# Altium schematic sheet AT89S52多功能板.SchDoc
size A4
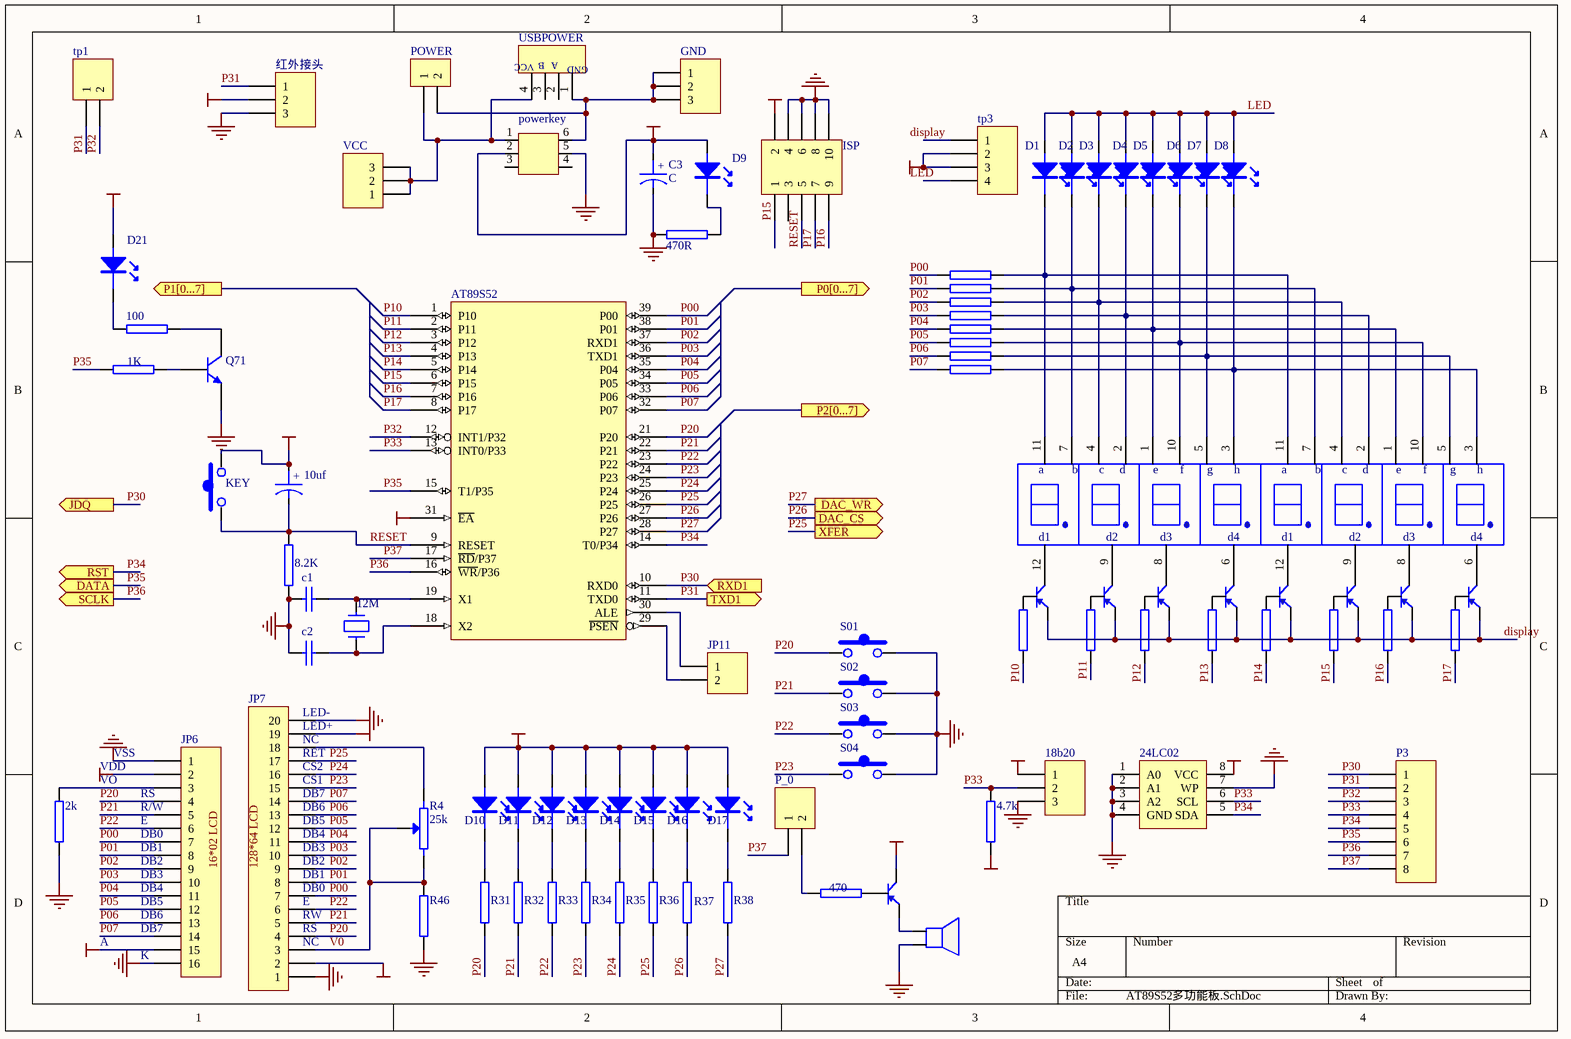
[diagram p0: AT89S52多功能板.SchDoc]

## Parts
1  NPN1  [NPN1PF]  (value not drawn)
1K  RES34  [RES1PF]  (value not drawn)
2  2  [NPN1PF]  (value not drawn)
2k  R5  [RES1PF]  (value not drawn)
3  3  [NPN1PF]  (value not drawn)
4  NPN1  [NPN1PF]  (value not drawn)
4.7k  RES1  [RES1PF]  (value not drawn)
5  NPN1  [NPN1PF]  (value not drawn)
6  NPN1  [NPN1PF]  (value not drawn)
7  NPN1  [NPN1PF]  (value not drawn)
8  NPN1  [NPN1PF]  (value not drawn)
8.2K  RES1  [RES1PF]  (value not drawn)
10  NPN1  [NPN1PF]  (value not drawn)
10uf  10uf  [cap2]  (value not drawn)
12M  12M  [CRYSTAL]  (value not drawn)
18b20  CON3  [HDR1X3]  (value not drawn)
24LC02  24LC02  [DIP8]  (value not drawn)
100  RES2  [RES1PF]  (value not drawn)
211  USBPOWER  [USBPOWER1]
470  R2  [RES1PF]  (value not drawn)
470R  R1  [RES1PF]  (value not drawn)
1111  LED8  [LED8PF]  (value not drawn)
1112  LED8  [LED8PF]  (value not drawn)
*  LS1  [LS1PF]  (value not drawn)
AT89S52  AT89S52  [AT89S52PF]  (value not drawn)
c1  C  [RAD0.3]  (value not drawn)
c2  15p  [RAD0.3]  (value not drawn)
C3  C  [RAD0.3]
D1  LED  [RES1PF]  (value not drawn)
D2  LED  [RES1PF]  (value not drawn)
D3  LED  [RES1PF]  (value not drawn)
D4  LED  [RES1PF]  (value not drawn)
D5  LED  [RES1PF]  (value not drawn)
D6  LED  [RES1PF]  (value not drawn)
D7  LED  [RES1PF]  (value not drawn)
D8  LED  [RES1PF]  (value not drawn)
D9  LED  [RES1PF]  (value not drawn)
D10  LED  [RES1PF]  (value not drawn)
D11  LED  [RES1PF]  (value not drawn)
D12  LED  [RES1PF]  (value not drawn)
D13  LED  [RES1PF]  (value not drawn)
D14  LED  [RES1PF]  (value not drawn)
D15  LED  [RES1PF]  (value not drawn)
D16  LED  [RES1PF]  (value not drawn)
D17  LED  [RES1PF]  (value not drawn)
D21  LED  [LED]  (value not drawn)
GND  公共电源  [HDR1X3]  (value not drawn)
ISP  download  [HDR2X5]  (value not drawn)
JP6  Header 16  [HDR1X16]  (value not drawn)
JP7  (no value)  [HDR1X20]
JP11  Header 2  [HDR1X2]  (value not drawn)
P3  Header 8  [HDR1X8]  (value not drawn)
P_0  Header 2  [HDR1X2]  (value not drawn)
POWER  POWER  [POWERPF]  (value not drawn)
powerkey  POWERKEY  [POWERKEY1]  (value not drawn)
Q71  2N3904  [TO-92A]  (value not drawn)
R4  25k  [SIP3-D]
R11  RES1  [RES1PF]  (value not drawn)
R12  RES1  [RES1PF]  (value not drawn)
R13  RES1  [RES1PF]  (value not drawn)
R14  RES1  [RES1PF]  (value not drawn)
R15  RES1  [RES1PF]  (value not drawn)
R16  RES1  [RES1PF]  (value not drawn)
R17  RES1  [RES1PF]  (value not drawn)
R18  RES1  [RES1PF]  (value not drawn)
R21  RES1  [RES1PF]  (value not drawn)
R22  RES1  [RES1PF]  (value not drawn)
R23  RES1  [RES1PF]  (value not drawn)
R24  RES1  [RES1PF]  (value not drawn)
R25  RES1  [RES1PF]  (value not drawn)
R26  RES1  [RES1PF]  (value not drawn)
R27  RES1  [RES1PF]  (value not drawn)
R28  RES1  [RES1PF]  (value not drawn)
R31  RES1  [RES1PF]  (value not drawn)
R32  RES1  [RES1PF]  (value not drawn)
R33  RES1  [RES1PF]  (value not drawn)
R34  RES1  [RES1PF]  (value not drawn)
R35  RES1  [RES1PF]  (value not drawn)
R36  RES1  [RES1PF]  (value not drawn)
R37  RES1  [RES1PF]  (value not drawn)
R38  RES1  [RES1PF]  (value not drawn)
R46  RES1  [RES1PF]  (value not drawn)
reset  KEY  [keypf]
S01  KEY  [KEYPF]  (value not drawn)
S02  KEY  [KEYPF]  (value not drawn)
S03  KEY  [KEYPF]  (value not drawn)
S04  KEY  [KEYPF]  (value not drawn)
tp1  Header 2  [HDR1X2]  (value not drawn)
tp3  Header 4  [HDR1X4]  (value not drawn)
VCC  (no value)  [HDR1X3]
红外接头  Header 3  [HDR1X3]  (value not drawn)

## Ports
DAC_CS (out), DAC_WR (out), DATA (out), JDQ (out), P0[0...7] (out), P1[0...7] (out), P2[0...7] (out), RST (out), RXD1 (in), SCLK (out), TXD1 (out), XFER (out)

## Nets
GND: 2k.1 8.2K.2 18b20.3 24LC02.1(A0) 24LC02.2(A1) 24LC02.3(A2) 24LC02.4(GND) 24LC02.7(WP) 470R.2 *.2 AT89S52.20(GND) c1.1 c2.1 C3.2 ISP.4 ISP.6 ISP.8 ISP.10 JP6.1 JP6.16 JP7.1 JP7.20 powerkey.5 Q71.1(E) R46.1 S01.2 S02.2 S03.2 S04.2 红外接头.3
VCC: 4.7k.1 10.c 10uf.1 18b20.1 24LC02.8(VCC) AT89S52.31(~{EA}) AT89S52.40(VCC) C3.1 D9.1(A) D10.1(A) D11.1(A) D12.1(A) D13.1(A) D14.1(A) D15.1(A) D16.1(A) D17.1(A) D21.1(A) ISP.2 JP6.2 JP6.15 JP7.2 JP7.19 powerkey.2 reset.2 tp3.2 tp3.3 红外接头.2
display: 1.e 2.e 3.e 4.e 5.e 6.e 7.e 8.e
LED: D1.1(A) D2.1(A) D3.1(A) D4.1(A) D5.1(A) D6.1(A) D7.1(A) D8.1(A)
P00: AT89S52.39(P00) JP6.7 JP7.7 R21.1
P01: AT89S52.38(P01) JP6.8 JP7.8 R22.1
P02: AT89S52.37(RXD1) JP6.9 JP7.9 R23.1
P03: AT89S52.36(TXD1) JP6.10 JP7.10 R24.1
P04: AT89S52.35(P04) JP6.11 JP7.11 R25.1
P05: AT89S52.34(P05) JP6.12 JP7.12 R26.1
P06: AT89S52.33(P06) JP6.13 JP7.13 R27.1
P07: AT89S52.32(P07) JP6.14 JP7.14 R28.1
P10: AT89S52.1(P10) R11.1
P11: AT89S52.2(P11) R12.1
P12: AT89S52.3(P12) R13.1
P13: AT89S52.4(P13) R14.1
P14: AT89S52.5(P14) R15.1
P15: AT89S52.6(P15) ISP.1 R16.1
P16: AT89S52.7(P16) ISP.9 R17.1
P17: AT89S52.8(P17) ISP.7 R18.1
P20: AT89S52.21(P20) JP6.4 JP7.4 R31.1 S01.1
P21: AT89S52.22(P21) JP6.5 JP7.5 R32.1 S02.1
P22: AT89S52.23(P22) JP6.6 JP7.6 R33.1 S03.1
P23: AT89S52.24(P23) JP7.15 R34.1 S04.1
P24: AT89S52.25(P24) JP7.16 R35.1
P25: AT89S52.26(P25) JP7.17 R36.1 ; port XFER
P26: AT89S52.27(P26) R37.1 ; port DAC_CS
P27: AT89S52.28(P27) R38.1 ; port DAC_WR
P30: AT89S52.10(RXD0) P3.1 ; port RXD1, port JDQ
P31: AT89S52.11(TXD0) P3.2 tp1.1 红外接头.1 ; port TXD1
P32: AT89S52.12(INT1/P32) P3.3 tp1.2
P33: 4.7k.2 18b20.2 24LC02.6(SCL) AT89S52.13(INT0/P33) P3.4
P34: 24LC02.5(SDA) AT89S52.14(T0/P34) P3.5 ; port RST
P35: 1K.1 AT89S52.15(T1/P35) P3.6 ; port DATA
P36: AT89S52.16(~{WR}/P36) P3.7 ; port SCLK
P37: AT89S52.17(~{RD}/P37) P3.8 P_0.1
RESET: 8.2K.1 10uf.2 AT89S52.9(RESET) ISP.5 reset.1
V0: JP7.3 R4.1 R4.3(W) R46.2
Net1_b: 1.b R11.2
Net1_c: 1.c 1112.12(d1)
Net1K_2: 1K.2 Q71.2(B)
Net2_b: 2.b R12.2
Net2_c: 2.c 1112.9
Net2k_2: 2k.2 JP6.3
Net3_b: 3.b R13.2
Net3_c: 3.c 1112.8
Net4_b: 4.b R14.2
Net4_c: 4.c 1112.6
Net5_b: 5.b R15.2
Net5_c: 5.c 1111.12(d1)
Net6_b: 6.b R16.2
Net6_c: 6.c 1111.9
Net7_b: 7.b R17.2
Net7_c: 7.c 1111.8
Net8_b: 8.b R18.2
Net8_c: 8.c 1111.6
Net10_b: 10.b 470.1
Net10_e: 10.e *.1
Net12M_1: 12M.1 AT89S52.19(X1) c1.2
Net12M_2: 12M.2 AT89S52.18(X2) c2.2
Net100_1: 100.1 D21.2(K)
Net100_2: 100.2 Q71.3(C)
Net211_1: 211.1(VCC) GND.1 GND.2 GND.3 POWER.2 powerkey.6
Net211_4: 211.4 POWER.1 powerkey.1 VCC.1 VCC.2 VCC.3
Net470_2: 470.2 P_0.2
Net470R_1: 470R.1 D9.2(K)
Net1111_1: 1111.1 1112.1 D5.2(K) R25.2
Net1111_2: 1111.2 1112.2 D4.2(K) R24.2
Net1111_3: 1111.3 1112.3 D8.2(K) R28.2
Net1111_4: 1111.4 1112.4 D3.2(K) R23.2
Net1111_5: 1111.5 1112.5 D7.2(K) R27.2
Net1111_7: 1111.7 1112.7 D2.2(K) R22.2
Net1111_10: 1111.10 1112.10 D6.2(K) R26.2
Net1111_11: 1111.11 1112.11 D1.2(K) R21.2
NetAT89S52_29: AT89S52.29(~{PSEN}) JP11.2
NetAT89S52_30: AT89S52.30(ALE) JP11.1
NetD10_2: D10.2(K) R31.2
NetD11_2: D11.2(K) R32.2
NetD12_2: D12.2(K) R33.2
NetD13_2: D13.2(K) R34.2
NetD14_2: D14.2(K) R35.2
NetD15_2: D15.2(K) R36.2
NetD16_2: D16.2(K) R37.2
NetD17_2: D17.2(K) R38.2
NetJP7_18: JP7.18 R4.2

Not connected (* = marked no-connect by the designer): 211 2 3(2); ISP 3; powerkey 3 4; tp3 1 4

## Notes on the sheet
- (near JP7) LED-
- VDD
- (near 2k) VO
- VSS
- (near JP7) CS2
- (near JP7) NC
- (near JP7) CS1
- (near JP7) RET
- (near JP7) LED+
- (near JP6) RS
- (near JP6) R/W
- (near JP6) E
- (near JP6) DB0
- (near JP6) DB1
- (near JP7) DB3
- (near JP7) DB4
- (near JP7) DB5
- (near JP7) DB6
- (near JP7) DB7
- (near JP6) DB2
- (near JP6) DB3
- (near JP6) DB4
- (near JP6) DB5
- (near JP6) DB6
- (near JP7) RW
- (near JP7) E
- (near JP7) DB0
- (near JP7) DB1
- (near JP7) DB2
- A
- (near JP6) DB7
- (near JP6) K
- (near JP7) RS
- Labels drawn without touching a wire or pin: 16*02 LCD, 128*64 LCD, display, LED
- (in symbol CAPACITOR POL) +
- (in symbol LED8) a; b; c; d; e; f; g; h; d2; d3; d4
- (in symbol USBPOWER) B; A; GND

## Library data of the parts
1K 2k 100 470 470R = RES1
2 3 = NPN1
10uf C3 = CAPACITOR POL: Capacitor
12M = CRYSTAL
18b20 GND VCC 红外接头 = Header 3: Header, 3-Pin; Revision: 17-Jul-2002: Re-released for DXP Platform.; Publisher: Altium Limited
AT89S52 = 8051
c1 c2 = CAP: Capacitor
ISP = Header 5X2: Header, 5-Pin, Dual row; Revision: 17-Jul-2002: Re-released for DXP Platform.; Publisher: Altium Limited
JP6 = Header 16: Header, 16-Pin; Revision: 17-Jul-2002: Re-released for DXP Platform.; Publisher: Altium Limited
JP7 = Header 20: Header, 20-Pin; Revision: 17-Jul-2002: Re-released for DXP Platform.; Publisher: Altium Limited
JP11 P_0 tp1 = Header 2: Header, 2-Pin; Publisher: Altium Limited
  JP11 tp1: Revision: 17-Jul-2002: Re-released for DXP Platform.
  P_0: LatestRevisionDate: 17-Jul-2002; LatestRevisionNote: Re-released for DXP Platform.
P3 = Header 8: Header, 8-Pin; Revision: 17-Jul-2002: Re-released for DXP Platform.; Publisher: Altium Limited
Q71 = 2N3904: NPN General Purpose Amplifier; Published: 8-Jun-2000; LatestRevisionDate: 15-Jan-2003; LatestRevisionNote: PCB Footprint 'BCY-W3/D4.7' replaced; DatasheetDocument: 1997; PackageDocument: Sep-1998; PackageReference: TO-92A; Publisher: Altium Limited; Code_JEDEC: TO-92A; ComponentLink1Description: Manufacturer Link; ComponentLink1URL: http://www.fairchildsemi.com/; ComponentLink2Description: Datasheet; ComponentLink2URL: http://www.fairchildsemi.com/ds/2N%2F2N3904.pdf
R4 = POT2: Potentiometer
tp3 = Header 4: Header, 4-Pin; Revision: 17-Jul-2002: Re-released for DXP Platform.; Publisher: Altium Limited